# Altium project PCB_Project.PrjPcb
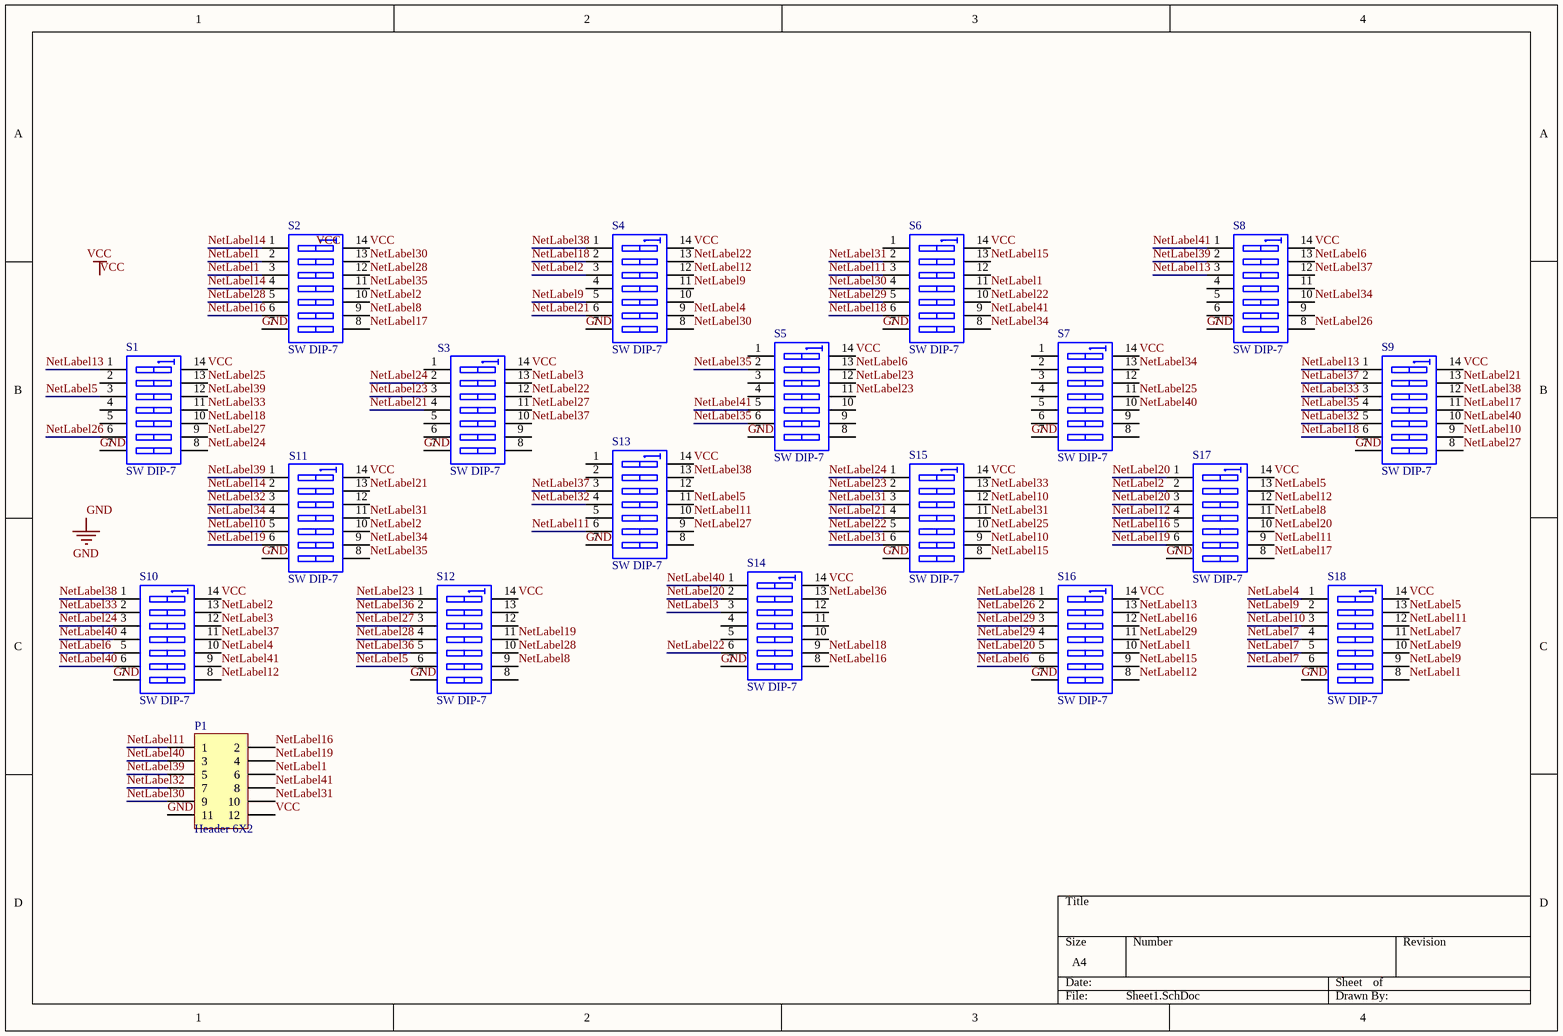
[diagram p0: Sheet1.SchDoc]
1 sheet, 19 parts. Net scope: global (net labels, ports and power ports of the same name join across sheets).
Board file: PCB1.PcbDoc

## Sheet Sheet1.SchDoc
size A4

### Parts
P1  Header 6X2  [HDR2X6]
S1  SW DIP-7  [DIP-14]
S2  SW DIP-7  [DIP-14]
S3  SW DIP-7  [DIP-14]
S4  SW DIP-7  [DIP-14]
S5  SW DIP-7  [DIP-14]
S6  SW DIP-7  [DIP-14]
S7  SW DIP-7  [DIP-14]
S8  SW DIP-7  [DIP-14]
S9  SW DIP-7  [DIP-14]
S10  SW DIP-7  [DIP-14]
S11  SW DIP-7  [DIP-14]
S12  SW DIP-7  [DIP-14]
S13  SW DIP-7  [DIP-14]
S14  SW DIP-7  [DIP-14]
S15  SW DIP-7  [DIP-14]
S16  SW DIP-7  [DIP-14]
S17  SW DIP-7  [DIP-14]
S18  SW DIP-7  [DIP-14]

### Nets
GND: P1.11 S1.7(A7) S2.7(A7) S3.7(A7) S4.7(A7) S5.7(A7) S6.7(A7) S7.7(A7) S8.7(A7) S9.7(A7) S10.7(A7) S11.7(A7) S12.7(A7) S13.7(A7) S14.7(A7) S15.7(A7) S16.7(A7) S17.7(A7) S18.7(A7)
VCC: P1.12 S1.14(B1) S2.14(B1) S3.14(B1) S4.14(B1) S5.14(B1) S6.14(B1) S7.14(B1) S8.14(B1) S9.14(B1) S10.14(B1) S11.14(B1) S12.14(B1) S13.14(B1) S14.14(B1) S15.14(B1) S16.14(B1) S17.14(B1) S18.14(B1)
NetLabel1: P1.6 S2.2(A2) S2.3(A3) S6.11(B4) S16.10(B5) S18.8(B7)
NetLabel2: S2.10(B5) S4.3(A3) S10.13(B2) S11.10(B5) S17.2(A2)
NetLabel3: S3.13(B2) S10.12(B3) S14.3(A3)
NetLabel4: S4.9(B6) S10.10(B5) S18.1(A1)
NetLabel5: S1.3(A3) S12.6(A6) S13.11(B4) S17.13(B2) S18.13(B2)
NetLabel6: S5.13(B2) S8.13(B2) S10.5(A5) S16.6(A6)
NetLabel7: S18.4(A4) S18.5(A5) S18.6(A6) S18.11(B4)
NetLabel8: S2.9(B6) S12.9(B6) S17.11(B4)
NetLabel9: S4.5(A5) S4.11(B4) S18.2(A2) S18.9(B6) S18.10(B5)
NetLabel10: S9.9(B6) S11.5(A5) S15.9(B6) S15.12(B3) S18.3(A3)
NetLabel11: P1.1 S6.3(A3) S13.6(A6) S13.10(B5) S17.9(B6) S18.12(B3)
NetLabel12: S4.12(B3) S10.8(B7) S16.8(B7) S17.4(A4) S17.12(B3)
NetLabel13: S1.1(A1) S8.3(A3) S9.1(A1) S16.13(B2)
NetLabel14: S2.1(A1) S2.4(A4) S11.2(A2)
NetLabel15: S6.13(B2) S15.8(B7) S16.9(B6)
NetLabel16: P1.2 S2.6(A6) S14.8(B7) S16.12(B3) S17.5(A5)
NetLabel17: S2.8(B7) S9.11(B4) S17.8(B7)
NetLabel18: S1.10(B5) S4.2(A2) S6.6(A6) S9.6(A6) S14.9(B6)
NetLabel19: P1.4 S11.6(A6) S12.11(B4) S17.6(A6)
NetLabel20: S14.2(A2) S16.5(A5) S17.1(A1) S17.3(A3) S17.10(B5)
NetLabel21: S3.4(A4) S4.6(A6) S9.13(B2) S11.13(B2) S15.4(A4)
NetLabel22: S3.12(B3) S4.13(B2) S6.10(B5) S14.6(A6) S15.5(A5)
NetLabel23: S3.3(A3) S5.11(B4) S5.12(B3) S12.1(A1) S15.2(A2)
NetLabel24: S1.8(B7) S3.2(A2) S10.3(A3) S15.1(A1)
NetLabel25: S1.13(B2) S7.11(B4) S15.10(B5)
NetLabel26: S1.6(A6) S8.8(B7) S16.2(A2)
NetLabel27: S1.9(B6) S3.11(B4) S9.8(B7) S12.3(A3) S13.9(B6)
NetLabel28: S2.5(A5) S2.12(B3) S12.4(A4) S12.10(B5) S16.1(A1)
NetLabel29: S6.5(A5) S16.3(A3) S16.4(A4) S16.11(B4)
NetLabel30: P1.9 S2.13(B2) S4.8(B7) S6.4(A4)
NetLabel31: P1.10 S6.2(A2) S11.11(B4) S15.3(A3) S15.6(A6) S15.11(B4)
NetLabel32: P1.7 S9.5(A5) S11.3(A3) S13.4(A4)
NetLabel33: S1.11(B4) S9.3(A3) S10.2(A2) S15.13(B2)
NetLabel34: S6.8(B7) S7.13(B2) S8.10(B5) S11.4(A4) S11.9(B6)
NetLabel35: S2.11(B4) S5.2(A2) S5.6(A6) S9.4(A4) S11.8(B7)
NetLabel36: S12.2(A2) S12.5(A5) S14.13(B2)
NetLabel37: S3.10(B5) S8.12(B3) S9.2(A2) S10.11(B4) S13.3(A3)
NetLabel38: S4.1(A1) S9.12(B3) S10.1(A1) S13.13(B2)
NetLabel39: P1.5 S1.12(B3) S8.2(A2) S11.1(A1)
NetLabel40: P1.3 S7.10(B5) S9.10(B5) S10.4(A4) S10.6(A6) S14.1(A1)
NetLabel41: P1.8 S5.5(A5) S6.9(B6) S8.1(A1) S10.9(B6)

Not connected (* = marked no-connect by the designer): S1 2(A2) 4(A4) 5(A5); S3 1(A1) 5(A5) 6(A6) 8(B7) 9(B6); S4 4(A4) 10(B5); S5 1(A1) 3(A3) 4(A4) 8(B7) 9(B6) 10(B5); S6 1(A1) 12(B3); S7 1(A1) 2(A2) 3(A3) 4(A4) 5(A5) 6(A6) 8(B7) 9(B6) 12(B3); S8 4(A4) 5(A5) 6(A6) 9(B6) 11(B4); S11 12(B3); S12 8(B7) 12(B3) 13(B2); S13 1(A1) 2(A2) 5(A5) 8(B7) 12(B3); S14 4(A4) 5(A5) 10(B5) 11(B4) 12(B3)

### Notes on the sheet
- Labels drawn without touching a wire or pin: VCC

### Library data of the parts
P1 = Header 6X2: Header, 6-Pin, Dual row; LatestRevisionDate: 17-Jul-2002; LatestRevisionNote: Re-released for DXP Platform.; Publisher: Altium Limited
S1-S18 = SW DIP-7: DIP Switch, 7 Position, SPST; Published: 24-Mar-1999; LatestRevisionDate: 17-Jul-2002; LatestRevisionNote: Re-released for DXP Platform.; PackageReference: DIP-14; Publisher: Altium Limited; Code_JEDEC: MO-001-AF